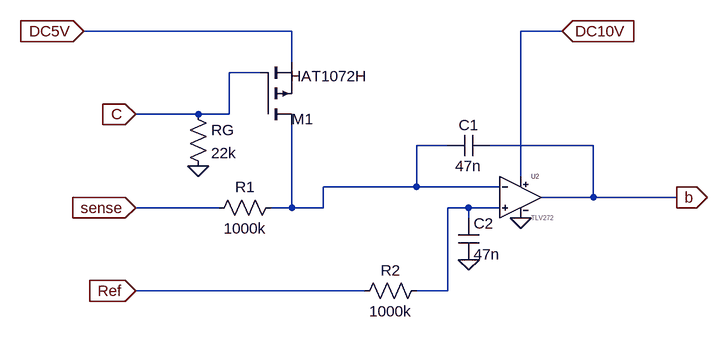
[diagram p0: schematic Feedback_control_circuit.asc]
Feedback_control_circuit.asc, the LTspice schematic file:
Version 4
SHEET 1 1252 680
WIRE 400 -16 80 -16
WIRE 816 -16 752 -16
WIRE 400 32 400 -16
WIRE 352 48 304 48
WIRE 256 112 160 112
WIRE 304 112 304 48
WIRE 304 112 256 112
WIRE 640 160 592 160
WIRE 864 160 704 160
WIRE 752 208 752 -16
WIRE 592 224 592 160
WIRE 592 224 448 224
WIRE 720 224 592 224
WIRE 864 240 864 160
WIRE 864 240 784 240
WIRE 992 240 864 240
WIRE 288 256 160 256
WIRE 400 256 400 128
WIRE 400 256 368 256
WIRE 448 256 448 224
WIRE 448 256 400 256
WIRE 672 256 640 256
WIRE 720 256 672 256
WIRE 672 272 672 256
WIRE 512 384 160 384
WIRE 640 384 640 256
WIRE 640 384 592 384
FLAG 256 192 0
FLAG 160 112 C
IOPIN 160 112 In
FLAG 160 256 sense
IOPIN 160 256 In
FLAG 80 -16 DC5V
IOPIN 80 -16 In
FLAG 816 -16 DC10V
IOPIN 816 -16 In
FLAG 992 240 b
IOPIN 992 240 Out
FLAG 160 384 Ref
IOPIN 160 384 In
FLAG 752 272 0
FLAG 672 336 0
SYMBOL res 240 96 R0
SYMATTR InstName RG
SYMATTR Value 22k
SYMBOL pmos 352 128 M180
WINDOW 3 165 75 Right 2
WINDOW 0 65 24 Bottom 2
SYMATTR Value HAT1072H
SYMATTR InstName M1
SYMBOL res 272 272 R270
WINDOW 0 32 56 VTop 2
WINDOW 3 0 56 VBottom 2
SYMATTR InstName R1
SYMATTR Value 1000k
SYMBOL cap 640 176 R270
WINDOW 0 32 32 VTop 2
WINDOW 3 0 32 VBottom 2
SYMATTR InstName C1
SYMATTR Value 47n
SYMBOL TLV272 752 240 R0
SYMATTR InstName U2
SYMBOL res 608 368 R90
WINDOW 0 0 56 VBottom 2
WINDOW 3 32 56 VTop 2
SYMATTR InstName R2
SYMATTR Value 1000k
SYMBOL cap 656 272 R0
SYMATTR InstName C2
SYMATTR Value 47n

The netlist it stands for:
* Feedback_control_circuit.asc
RG C 0 22k
M1 N001 C DC5V DC5V HAT1072H
R1 sense N001 1000k
C1 N001 b 47n
XU2 N002 N001 DC10V 0 b level.2 Avol=1Meg GBW=3Meg Slew=2.4Meg ilimit=20m rail=0.1 Vos=0 phimargin=45 en=0 enk=0 in=0 ink=0 Rin=500Meg  ; pins In+ In- V+ V- OUT
R2 N002 Ref 1000k
C2 N002 0 47n
.model NMOS NMOS
.model PMOS PMOS
.lib standard.mos
.lib UniversalOpamps2.sub
.backanno
.end